# EAGLE schematic MicroRC-C (EAGLE 6.5.0)
CHECKED: K.OLINGER; DATABASE: ./BOM/MicroRC-PARTSDB.txt; DATE: 10/10/06; DRAWN: R.STARR; DRGNO: ED-3XX-01; REV: C

## Sheet 1 of 3
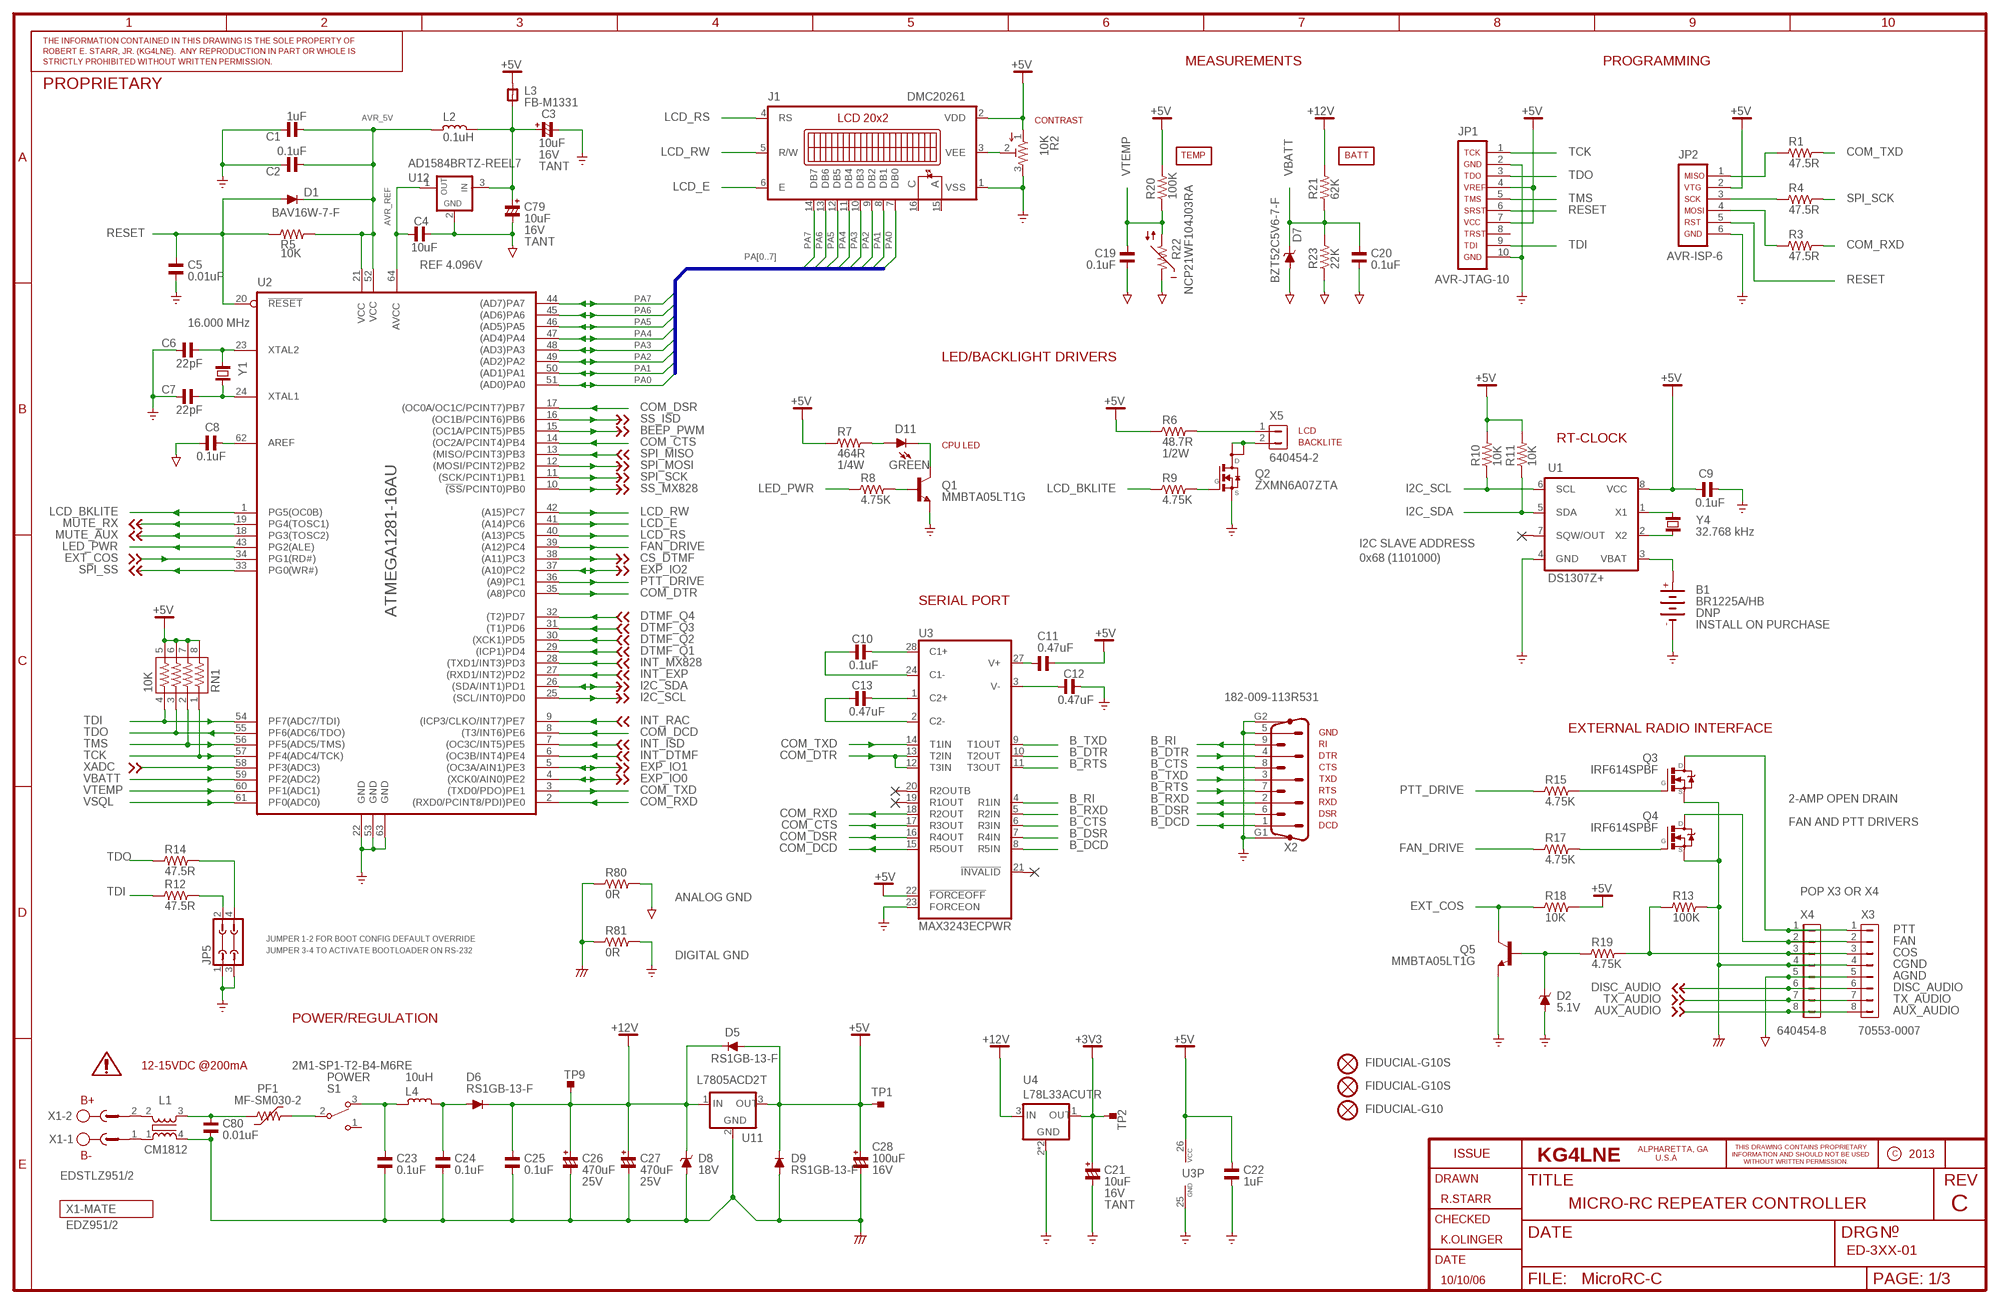
[diagram p0: schematic, sheet 1]
JMP1 (JUMP-Q): BOM: EXCLUDE
JMP2 (JUMP-Q): BOM: EXCLUDE
X1-MATE (BOM-ENTRY): PARTNO: EDZ951/2

### Parts
B1  BR1225A/HB  BR1225  [BR1225]
C1  1uF  C_0805  [C0805]
C2  0.1uF  C_0805  [C0805]
C3  10uF  CP_3528  [C3528/T]
C4  10uF  C_0805  [C0805]
C5  0.01uF  C_0805  [C0805]
C6  22pF  C_0805  [C0805]
C7  22pF  C_0805  [C0805]
C8  0.1uF  C_0805  [C0805]
C9  0.1uF  C_0805  [C0805]
C10  0.1uF  C_0805  [C0805]
C11  0.47uF  C_0805  [C0805]
C12  0.47uF  C_0805  [C0805]
C13  0.47uF  C_0805  [C0805]
C19  0.1uF  C_0805  [C0805]
C20  0.1uF  C_0805  [C0805]
C21  10uF  CP_3528  [C3528/T]
C22  1uF  C_0805  [C0805]
C23  0.1uF  C_1206  [C1206]
C24  0.1uF  C_1206  [C1206]
C25  0.1uF  C_1206  [C1206]
C26  470uF  CP_SV-G  [CSV-G]
C27  470uF  CP_SV-G  [CSV-G]
C28  100uF  CP_SV-E/F  [CSV-E/F]
C79  10uF  CP_3528  [C3528/T]
C80  0.01uF  C_1206  [C1206]
D1  BAV16W-7-F  DIODE-SOD123  [SOD123]
D2  5.1V  ZENER-DIODESOD123  [SOD123]
D5  RS1GB-13-F  S1GB-13  [SMB]
D6  RS1GB-13-F  S1GB-13  [SMB]
D7  BZT52C5V6-7-F  ZENER-DIODESOD123  [SOD123]
D8  18V  ZENER-DIODESMB  [SMB]
D9  RS1GB-13-F  S1GB-13  [SMB]
D11  GREEN  LED535XX  [LED535]
FIDUCIAL1  FIDUCIAL-G10S  [G10S]
FIDUCIAL2  FIDUCIAL-G10S  [G10S]
FIDUCIAL3  FIDUCIAL-G10  [G10]
J1  DMC20261  [DMC20261]
JP1  AVR-JTAG-10  [AVR-JTAG-10]
JP2  AVR-ISP-6  [AVR-ISP-6]
JP5  JP2Q  [JP2Q]
L1  CM1812  [CM1812]
L2  0.1uH  L_1206  [L1206]
L3  FB-M1331  FB_1206  [L1206]
L4  10uH  L-PM3308  [PM-13]
PF1  MF-SM030-2  POLYSWITCH-SMD-7555  [SMD-7555]
Q1  MMBTA05LT1G  MMBTA05LT1  [SOT23]
Q2  ZXMN6A07ZTA  ZXMN6A07Z  [SOT89]
Q3  IRF614SPBF  IRF614  [D2PAK]
Q4  IRF614SPBF  IRF614  [D2PAK]
Q5  MMBTA05LT1G  MMBTA05LT1  [SOT23]
R1  47.5R  R_0805  [R0805]
R2  10K  TRIM_EU-EVM-L4G  [EVM-L4G]
R3  47.5R  R_0805  [R0805]
R4  47.5R  R_0805  [R0805]
R5  10K  R_0805  [R0805]
R6  48.7R  R_2010  [R2010]
R7  464R  R_1210  [R1210]
R8  4.75K  R_0805  [R0805]
R9  4.75K  R_0805  [R0805]
R10  10K  R_0805  [R0805]
R11  10K  R_0805  [R0805]
R12  47.5R  R_0805  [R0805]
R13  100K  R_0805  [R0805]
R14  47.5R  R_0805  [R0805]
R15  4.75K  R_0805  [R0805]
R17  4.75K  R_0805  [R0805]
R18  10K  R_0805  [R0805]
R19  4.75K  R_0805  [R0805]
R20  100K  R_0805  [R0805]
R21  62K  R_0805  [R0805]
R22  NCP21WF104J03RA  NCP-0805  [R0805]
R23  22K  R_0805  [R0805]
R80  0R  R_0805  [R0805]
R81  0R  R_0805  [R0805]
RN1  10K  744-8  [744-8]
S1  2M1-SP1-T2-B4-M6RE  CK-A  [CK-A]
TP1  TPTP10SQ  [TP10SQ]
TP2  TPTP10SQ  [TP10SQ]
TP9  TPTP10SQ  [TP10SQ]
U1  DS1307Z+  DS1307Z  [SO08]
U2  ATMEGA1281-16AU  MEGA1281/2561  [TQFP64-AEB]
U3  MAX3243ECPWR  MAX3243PW  [TSSOP28]
U4  L78L33ACUTR  L78LXXCU/BU  [SOT89-4]
U11  L7805ACD2T  L78XXD2T  [D2PAK]
U12  AD1584BRTZ-REEL7  AD158X  [SOT23]
X1  EDSTLZ951/2  EDSTLZ-2-951  [951-2]
X2  182-009-113R531  NC182M9-VS  [NC182M9]
X3  70553-0007  HDR-1X8-70553-?  [70553-08]
X4  640454-8  MTA08-100  [MTA08-100]
X5  640454-2  HDR-1X2-MTA-100  [MTA-100-2V]
Y1  16.000 MHz  CRYTALTC38H  [TC38H]
Y4  32.768 kHz  CRYTALTC26H  [TC26H]

### Nets
+3V3: C21.+ TP2.TP U4.1(OUT) ; also sheet 2
+5V: C9.1 C11.1 C22.1 C28.+ D5.A D9.C J1.2(VDD) JP1.4 JP1.7 JP2.2 L3.2 R2.1 R6.1 R7.1 R10.2 R11.2 R18.2 R20.2 RN1.5 RN1.6 RN1.7 RN1.8 TP1.TP U1.8(VCC) U3.22(!FORCEOFF!) U3.26(VCC) U11.3(OUT) ; also sheet 2
+12V: C25.1 C26.+ C27.+ D5.C D6.C D8.C R21.2 TP9.TP U4.3(IN) U11.1(IN) ; also sheet 2
AGND: C4.1 C8.2 C19.2 C20.2 C79.- D7.A R22.1 R23.1 R80.2 U12.2(GND) X3.5 X4.5 ; supply symbol labelled AGND_ ; also sheet 2
AUX_AUDIO: X3.8 X4.8 ; also sheet 2
AVR_5V: C1.1 C2.1 D1.C L2.2 R5.2 U2.21(VCC) U2.52(VCC1)
AVR_REF: C4.2 U2.64(AVCC) U12.1(OUT)
B_CTS: U3.6(R3IN) X2.8
B_DCD: U3.8(R5IN) X2.1
B_DSR: U3.7(R4IN) X2.6
B_DTR: U3.10(T2OUT) X2.4
B_RI: U3.4(R1IN) X2.9
B_RTS: U3.11(T3OUT) X2.7
B_RXD: U3.5(R2IN) X2.2
B_TXD: U3.9(T1OUT) X2.3
BEEP_PWM: U2.15((OC1A/PCINT5)PB5) ; also sheet 2
CGND: C23.2 C24.2 C25.2 C26.- C27.- C28.- C80.2 D8.A D9.A L1.4 Q3.3(S) Q4.3(S) R13.2 R80.1 R81.1 U11.2(GND) X3.4 X4.4 ; supply symbol labelled CGND_
COM_CTS: U2.14((OC2A/PCINT4)PB4) U3.17(R3OUT)
COM_DCD: U2.8((T3/INT6)PE6) U3.15(R5OUT)
COM_DSR: U2.17((OC0A/OC1C/PCINT7)PB7) U3.16(R4OUT)
COM_DTR: U2.35((A8)PC0) U3.12(T3IN) U3.13(T2IN)
COM_RXD: R3.2 U2.2((RXD0/PCINT8/PDI)PE0) U3.18(R2OUT)
COM_TXD: R1.2 U2.3((TXD0/PDO)PE1) U3.14(T1IN)
COS: R13.1 R19.2 X3.3 X4.3
CS_DTMF: U2.38((A11)PC3) ; also sheet 2
DISC_AUDIO: X3.6 X4.6 ; also sheet 2
DTMF_Q1: U2.29((ICP1)PD4) ; also sheet 2
DTMF_Q2: U2.30((XCK1)PD5) ; also sheet 2
DTMF_Q3: U2.31((T1)PD6) ; also sheet 2
DTMF_Q4: U2.32((T2)PD7) ; also sheet 2
EXP_IO0: U2.4((XCK0/AIN0)PE2) ; also sheet 2
EXP_IO1: U2.5((OC3A/AIN1)PE3) ; also sheet 2
EXP_IO2: U2.37((A10)PC2) ; also sheet 2
EXT_COS: Q5.3(C) R18.1 U2.34(PG1(RD#))
FAN: Q4.2(D) X3.2 X4.2
FAN_DRIVE: R17.1 U2.39((A12)PC4)
GND: B1.- C1.2 C2.2 C3.- C5.2 C6.2 C7.2 C9.2 C12.1 C21.- C22.2 D2.A J1.1(VSS) JP1.2 JP1.10 JP2.6 JP5.1 JP5.3 Q1.2(E) Q2.3(S) Q5.2(E) R2.3 R81.2 U1.4(GND) U2.22(GND) U2.53(GND1) U2.63(GND2) U3.23(FORCEON) U3.25(GND) U4.2(GND) U4.4(GND) X2.5 X2.G1 X2.G2 ; supply symbol labelled GND_ ; also sheet 2
I2C_SCL: R10.1 U1.6(SCL) U2.25((SCL/INT0)PD0) ; also sheet 2
I2C_SDA: R11.1 U1.5(SDA) U2.26((SDA/INT1)PD1) ; also sheet 2
INT_DTMF: U2.6((OC3B/INT4)PE4) ; also sheet 2
INT_EXP: U2.27((RXD1/INT2)PD2) ; also sheet 2
INT_ISD: U2.7((OC3C/INT5)PE5) ; also sheet 2
INT_MX828: U2.28((TXD1/INT3)PD3) ; also sheet 2
INT_RAC: U2.9((ICP3/CLKO/INT7)PE7) ; also sheet 2
LCD_BKLITE: R9.1 U2.1(PG5(OC0B))
LCD_E: J1.6(E) U2.41((A14)PC6)
LCD_RS: J1.4(RS) U2.40((A13)PC5)
LCD_RW: J1.5(R/W) U2.42((A15)PC7)
LED_PWR: R8.1 U2.43(PG2(ALE))
MUTE_AUX: U2.18(PG3(TOSC2)) ; also sheet 2
MUTE_RX: U2.19(PG4(TOSC1)) ; also sheet 2
N$1: L1.1 X1.1
N$2: C8.1 U2.62(AREF)
N$9: JP5.2 R12.2
N$13: C23.1 L4.1 S1.3(O)
N$14: L1.2 X1.2
N$19: C24.1 D6.A L4.2
N$20: U1.1(X1) Y4.2
N$21: U1.2(X2) Y4.1
N$30: C7.1 U2.24(XTAL1) Y1.1
N$31: JP5.4 R14.2
N$34: C12.2 U3.3(V-)
N$36: C11.2 U3.27(V+)
N$38: C6.1 U2.23(XTAL2) Y1.2
N$39: C13.1 U3.1(C2+)
N$44: C10.1 U3.28(C1+)
N$45: C13.2 U3.2(C2-)
N$46: C10.2 U3.24(C1-)
N$63: B1.+ U1.3(VBAT)
N$66: Q3.1(G) R15.2
N$67: Q2.1(G) R9.2
N$68: Q2.2(D) Q2.4(D2) X5.2
N$69: R6.2 X5.1
N$76: D2.C Q5.1(B) R19.1
N$78: PF1.2 S1.2(P)
N$79: Q4.1(G) R17.2
N$81: C80.1 L1.3 PF1.1
N$86: C3.+ C79.+ L2.1 L3.1 U12.3(IN)
N$90: D11.K(C) Q1.3(C)
N$91: D11.A R7.2
N$92: Q1.1(B) R8.2
N$105: JP2.1 R1.1
N$107: JP2.3 R4.1
N$108: JP2.4 R3.1
PA0: J1.7(DB0) U2.51((AD0)PA0)
PA1: J1.8(DB1) U2.50((AD1)PA1)
PA2: J1.9(DB2) U2.49((AD2)PA2)
PA3: J1.10(DB3) U2.48((AD3)PA3)
PA4: J1.11(DB4) U2.47((AD4)PA4)
PA5: J1.12(DB5) U2.46((AD5)PA5)
PA6: J1.13(DB6) U2.45((AD6)PA6)
PA7: J1.14(DB7) U2.44((AD7)PA7)
PTT: Q3.2(D) X3.1 X4.1
PTT_DRIVE: R15.1 U2.36((A9)PC1)
RESET: C5.1 D1.A JP1.6 JP2.5 R5.1 U2.20(!RESET!)
SPI_MISO: U2.13((MISO/PCINT3)PB3) ; also sheet 2
SPI_MOSI: U2.12((MOSI/PCINT2)PB2) ; also sheet 2
SPI_SCK: R4.2 U2.11((SCK/PCINT1)PB1) ; also sheet 2
SPI_SS: U2.33(PG0(WR#)) ; also sheet 2
SS_ISD: U2.16((OC1B/PCINT6)PB6) ; also sheet 2
SS_MX828: U2.10(!(SS!/PCINT0)PB0) ; also sheet 2
TCK: JP1.1 RN1.1 U2.57(PF4(ADC4/TCK))
TDI: JP1.9 R12.1 RN1.4 U2.54(PF7(ADC7/TDI))
TDO: JP1.3 R14.1 RN1.3 U2.55(PF6(ADC6/TDO))
TMS: JP1.5 RN1.2 U2.56(PF5(ADC5/TMS))
TX_AUDIO: X3.7 X4.7 ; also sheet 2
VBATT: C20.1 D7.C R21.1 R23.2 U2.59(PF2(ADC2))
VEE_LCD: J1.3(VEE) R2.2
VSQL: U2.61(PF0(ADC0)) ; also sheet 2
VTEMP: C19.1 R20.1 R22.2 U2.60(PF1(ADC1))
XADC: U2.58(PF3(ADC3)) ; also sheet 2
Unconnected: J1.15(A) J1.16(C) JP1.8 S1.1(S) U1.7(SQW/OUT) U3.19(R1OUT) U3.20(R2OUTB) U3.21(!INVALID!)

### Buses
PA[0..7]

### Notes on the sheet
- MEASUREMENTS | PROGRAMMING
- CONTRAST
- TEMP | BATT
- REF 4.096V
- LED/BACKLIGHT DRIVERS
- LCD
- RT-CLOCK
- BACKLITE
- CPU LED
- I2C SLAVE ADDRESS
- 0x68 (1101000)
- SERIAL PORT
- EXTERNAL RADIO INTERFACE
- GND
- RI
- DTR
- CTS
- TXD
- RTS
- 2-AMP OPEN DRAIN
- RXD
- DSR
- FAN AND PTT DRIVERS
- DCD
- ANALOG GND
- JUMPER 1-2 FOR BOOT CONFIG DEFAULT OVERRIDE
- JUMPER 3-4 TO ACTIVATE BOOTLOADER ON RS-232
- DIGITAL GND
- POWER/REGULATION
- 12-15VDC @200mA
- POWER
- B+
- B-
- MICRO-RC REPEATER CONTROLLER

## Sheet 2 of 3
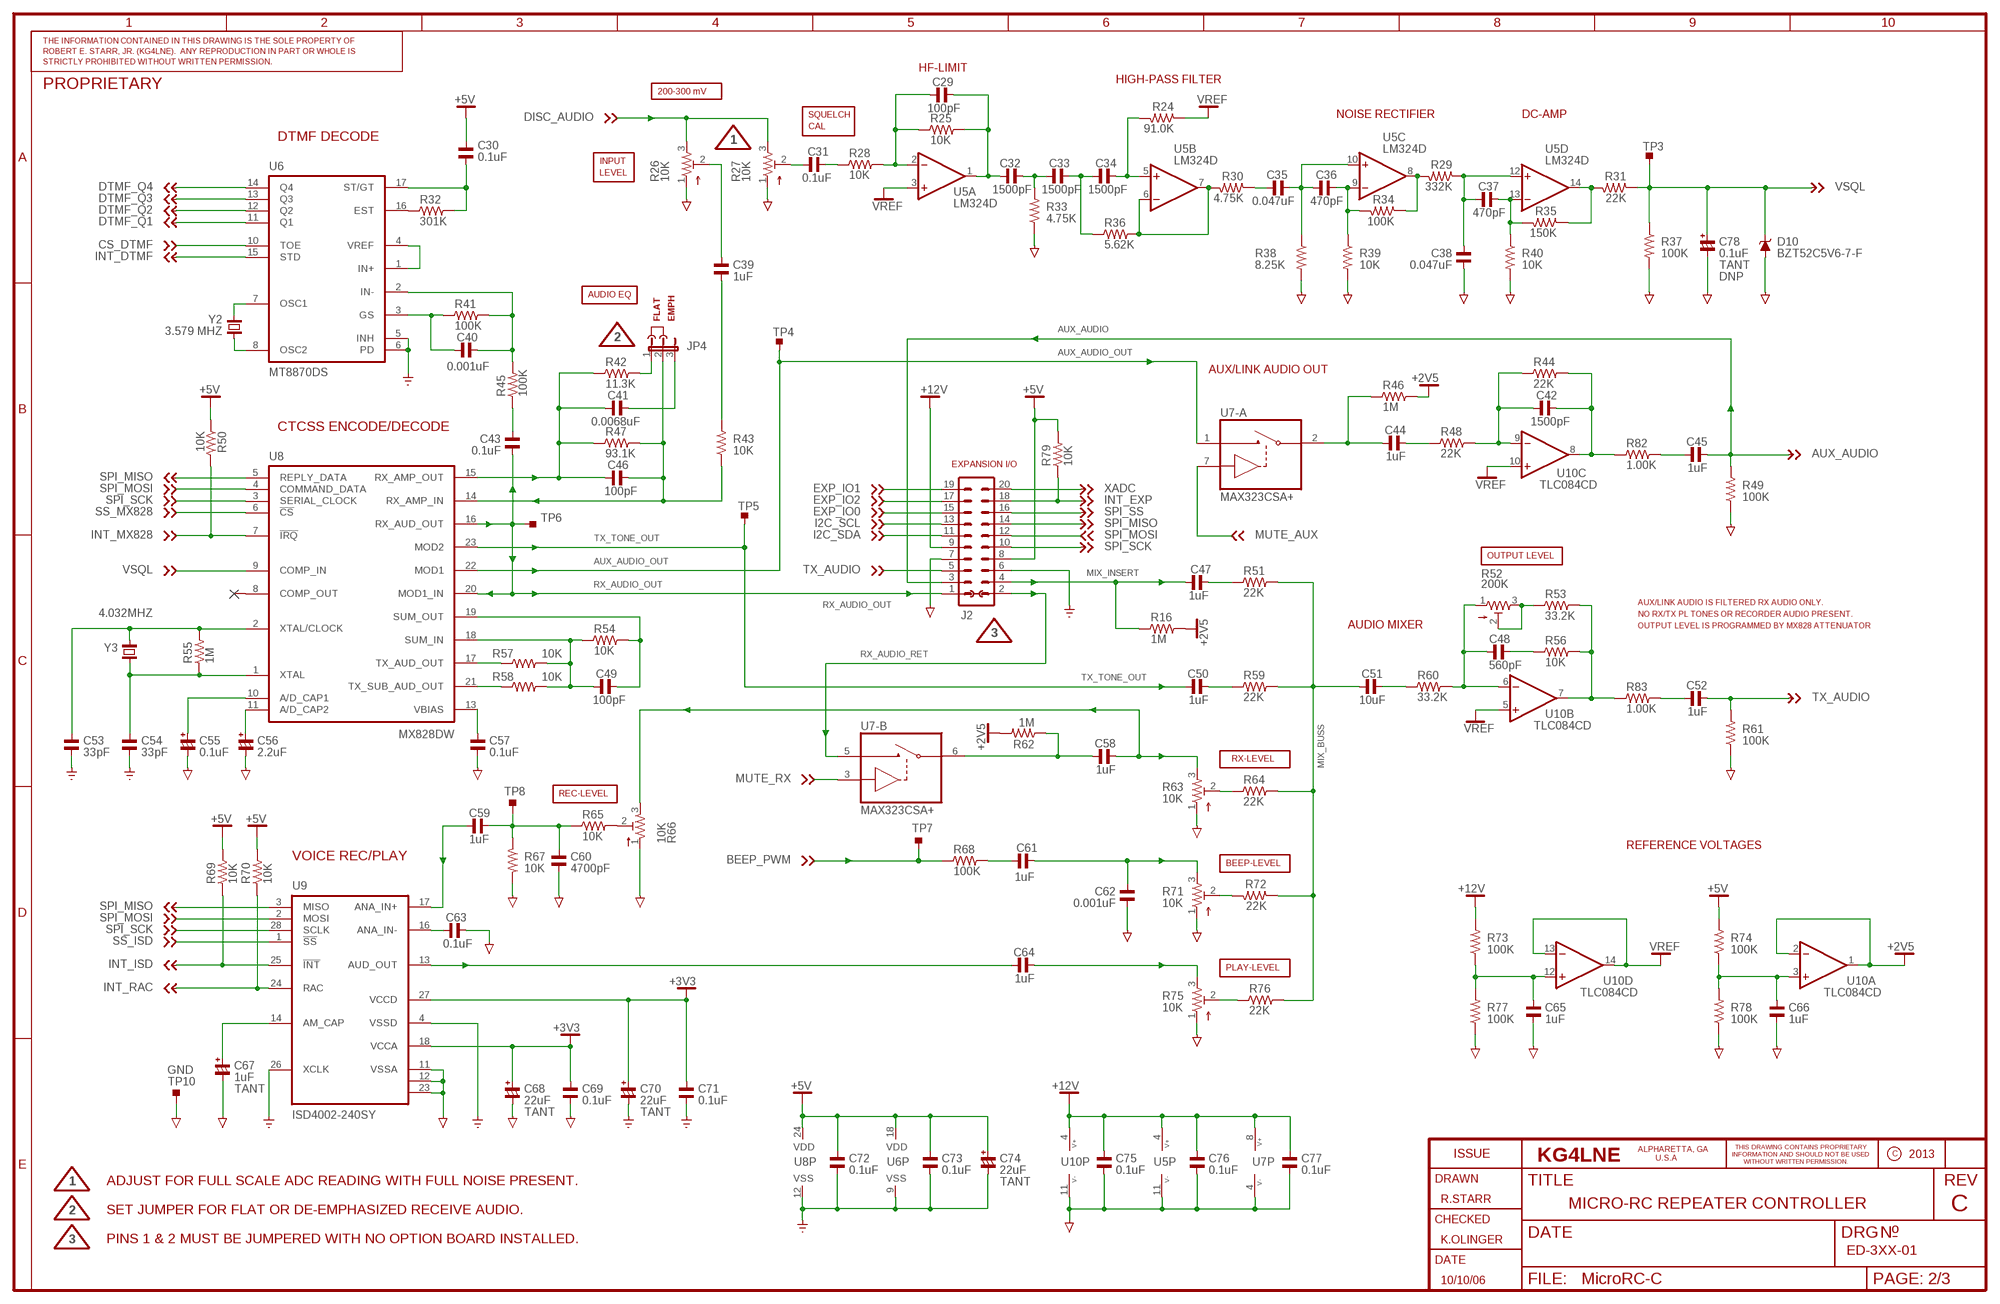
[diagram p1: schematic, sheet 2]
JUMPER (JUMPER): BOM: EXCLUDE

### Parts
C29  100pF  C_0805  [C0805]
C30  0.1uF  C_0805  [C0805]
C31  0.1uF  C_0805  [C0805]
C32  1500pF  C_0805  [C0805]
C33  1500pF  C_0805  [C0805]
C34  1500pF  C_0805  [C0805]
C35  0.047uF  C_0805  [C0805]
C36  470pF  C_0805  [C0805]
C37  470pF  C_0805  [C0805]
C38  0.047uF  C_0805  [C0805]
C39  1uF  C_0805  [C0805]
C40  0.001uF  C_0805  [C0805]
C41  0.0068uF  C_0805  [C0805]
C42  1500pF  C_0805  [C0805]
C43  0.1uF  C_0805  [C0805]
C44  1uF  C_0805  [C0805]
C45  1uF  C_0805  [C0805]
C46  100pF  C_0805  [C0805]
C47  1uF  C_0805  [C0805]
C48  560pF  C_0805  [C0805]
C49  100pF  C_0805  [C0805]
C50  1uF  C_0805  [C0805]
C51  10uF  C_0805  [C0805]
C52  1uF  C_0805  [C0805]
C53  33pF  C_0805  [C0805]
C54  33pF  C_0805  [C0805]
C55  0.1uF  CP_3216  [C3216/T]
C56  2.2uF  CP_3216  [C3216/T]
C57  0.1uF  C_0805  [C0805]
C58  1uF  C_0805  [C0805]
C59  1uF  C_0805  [C0805]
C60  4700pF  C_0805  [C0805]
C61  1uF  C_0805  [C0805]
C62  0.001uF  C_0805  [C0805]
C63  0.1uF  C_0805  [C0805]
C64  1uF  C_0805  [C0805]
C65  1uF  C_0805  [C0805]
C66  1uF  C_0805  [C0805]
C67  1uF  CP_3216  [C3216/T]
C68  22uF  CP_3528  [C3528/T]
C69  0.1uF  C_0805  [C0805]
C70  22uF  CP_3528  [C3528/T]
C71  0.1uF  C_0805  [C0805]
C72  0.1uF  C_0805  [C0805]
C73  0.1uF  C_0805  [C0805]
C74  22uF  CP_3528  [C3528/T]
C75  0.1uF  C_0805  [C0805]
C76  0.1uF  C_0805  [C0805]
C77  0.1uF  C_0805  [C0805]
C78  0.1uF  CP_3216  [C3216/T]
D10  BZT52C5V6-7-F  ZENER-DIODESOD123  [SOD123]
J2  MA10-2  [MA10-2]
JP4  JP2E  [JP2]
R16  1M  R_0805  [R0805]
R24  91.0K  R_0805  [R0805]
R25  10K  R_0805  [R0805]
R26  10K  TRIM_EU-EVME-SIDE  [EVME-SIDE]
R27  10K  TRIM_EU-EVME-SIDE  [EVME-SIDE]
R28  10K  R_0805  [R0805]
R29  332K  R_0805  [R0805]
R30  4.75K  R_0805  [R0805]
R31  22K  R_0805  [R0805]
R32  301K  R_0805  [R0805]
R33  4.75K  R_0805  [R0805]
R34  100K  R_0805  [R0805]
R35  150K  R_0805  [R0805]
R36  5.62K  R_0805  [R0805]
R37  100K  R_0805  [R0805]
R38  8.25K  R_0805  [R0805]
R39  10K  R_0805  [R0805]
R40  10K  R_0805  [R0805]
R41  100K  R_0805  [R0805]
R42  11.3K  R_0805  [R0805]
R43  10K  R_0805  [R0805]
R44  22K  R_0805  [R0805]
R45  100K  R_0805  [R0805]
R46  1M  R_0805  [R0805]
R47  93.1K  R_0805  [R0805]
R48  22K  R_0805  [R0805]
R49  100K  R_0805  [R0805]
R50  10K  R_0805  [R0805]
R51  22K  R_0805  [R0805]
R52  200K  TRIM_EU-EVME-SIDE  [EVME-SIDE]
R53  33.2K  R_0805  [R0805]
R54  10K  R_0805  [R0805]
R55  1M  R_0805  [R0805]
R56  10K  R_0805  [R0805]
R57  10K  R_0805  [R0805]
R58  10K  R_0805  [R0805]
R59  22K  R_0805  [R0805]
R60  33.2K  R_0805  [R0805]
R61  100K  R_0805  [R0805]
R62  1M  R_0805  [R0805]
R63  10K  TRIM_EU-EVME-SIDE  [EVME-SIDE]
R64  22K  R_0805  [R0805]
R65  10K  R_0805  [R0805]
R66  10K  TRIM_EU-EVM-L4G  [EVM-L4G]
R67  10K  R_0805  [R0805]
R68  100K  R_0805  [R0805]
R69  10K  R_0805  [R0805]
R70  10K  R_0805  [R0805]
R71  10K  TRIM_EU-EVME-SIDE  [EVME-SIDE]
R72  22K  R_0805  [R0805]
R73  100K  R_0805  [R0805]
R74  100K  R_0805  [R0805]
R75  10K  TRIM_EU-EVME-SIDE  [EVME-SIDE]
R76  22K  R_0805  [R0805]
R77  100K  R_0805  [R0805]
R78  100K  R_0805  [R0805]
R79  10K  R_0805  [R0805]
R82  1.00K  R_0805  [R0805]
R83  1.00K  R_0805  [R0805]
TP3  TPTP10SQ  [TP10SQ]
TP4  TPTP10SQ  [TP10SQ]
TP5  TPTP10SQ  [TP10SQ]
TP6  TPTP10SQ  [TP10SQ]
TP7  TPTP10SQ  [TP10SQ]
TP8  TPS-SMD-10SN  [SMD-10SN]
TP10  TPS-SMD-10SN  [SMD-10SN]
U5  LM324D  [SO14]
U6  MT8870DS  CM8870CS  [SO18W]
U7  MAX323CSA+  MAX323CSA  [SO08]
U8  MX828DW  MX828DS  [SSOP24]
U9  ISD4002-240SY  ISD4002S  [SO28W]
U10  TLC084CD  TL084D  [SO14]
Y2  3.579 MHZ  CRYTALTC310H  [TC310H]
Y3  4.032MHZ  CRYTALSM49  [SM49]

### Nets
+2V5: R16.2 R46.2 R62.2 U10.1(A:OUT) U10.2(A:-IN)
+3V3: C68.+ C69.1 C70.+ C71.1 U9.18(VCCA) U9.27(VCCD) ; also sheet 1
+5V: C30.2 C72.1 C73.1 C74.+ J2.8 R50.1 R69.2 R70.2 R74.2 R79.2 U6.18(VDD) U8.24(P:VDD) ; also sheet 1
+12V: C75.1 C76.1 C77.1 J2.9 R73.2 U5.4(P:V+) U7.8(P:V+) U10.4(P:V+) ; also sheet 1
AGND: C38.1 C55.- C56.- C57.2 C60.2 C62.2 C63.1 C65.2 C66.2 C67.- C68.- C69.2 C75.2 C76.2 C77.2 C78.- D10.A J2.7 R26.1 R27.1 R33.1 R37.2 R38.2 R39.2 R40.2 R49.1 R61.1 R63.1 R66.1 R67.2 R71.1 R75.1 R77.1 R78.1 TP10.TP U5.11(P:V-) U7.4(P:V-) U9.11(VSSA) U9.12(VSSA) U9.23(VSSA) U10.11(P:V-) ; supply symbol labelled AGND_ ; also sheet 1
AUX_AUDIO: C45.2 J2.3 R49.2 ; also sheet 1
AUX_AUDIO_OUT: TP4.TP U7.1(-A:NO) U8.22(A:MOD1)
BEEP_PWM: R68.1 TP7.TP ; also sheet 1
CS_DTMF: U6.10(TOE) ; also sheet 1
DISC_AUDIO: R26.3 R27.3 ; also sheet 1
DTMF_Q1: U6.11(Q1) ; also sheet 1
DTMF_Q2: U6.12(Q2) ; also sheet 1
DTMF_Q3: U6.13(Q3) ; also sheet 1
DTMF_Q4: U6.14(Q4) ; also sheet 1
EXP_IO0: J2.15 ; also sheet 1
EXP_IO1: J2.19 ; also sheet 1
EXP_IO2: J2.17 ; also sheet 1
GND: C53.2 C54.2 C70.- C71.2 C72.2 C73.2 C74.- J2.6 U6.5(INH) U6.6(PD) U6.9(VSS) U8.12(P:VSS) U9.4(VSSD) U9.26(XCLK) ; supply symbol labelled GND_ ; also sheet 1
I2C_SCL: J2.13 ; also sheet 1
I2C_SDA: J2.11 ; also sheet 1
INT_DTMF: U6.15(STD) ; also sheet 1
INT_EXP: J2.18 R79.1 ; also sheet 1
INT_ISD: R69.1 U9.25(!INT!) ; also sheet 1
INT_MX828: R50.2 U8.7(A:!IRQ!) ; also sheet 1
INT_RAC: R70.1 U9.24(RAC) ; also sheet 1
MIX_BUSS: C51.1 R51.2 R59.2 R64.2 R72.1 R76.2
MIX_INSERT: C47.1 J2.4 R16.1
MUTE_AUX: U7.7(-A:IN) ; also sheet 1
MUTE_RX: U7.3(-B:IN) ; also sheet 1
N$3: C45.1 R82.2
N$4: C39.2 R26.2
N$5: C58.1 R62.1 U7.6(-B:COM)
N$6: R63.2 R64.1
N$7: R65.2 R66.2
N$8: C63.2 U9.16(ANA_IN-)
N$10: C56.+ U8.11(A:A/D_CAP2)
N$11: C52.1 R83.2
N$12: JP4.1 R42.2
N$15: C59.1 C60.1 R65.1 R67.1 TP8.TP
N$16: U6.7(OSC1) Y2.2
N$17: U6.8(OSC2) Y2.1
N$18: U6.1(IN+) U6.4(VREF)
N$22: C61.1 R68.2
N$23: R75.2 R76.1
N$24: C65.1 R73.1 R77.2 U10.12(D:+IN)
N$25: C64.2 R75.3
N$26: C40.2 R41.2 R45.2 U6.2(IN-)
N$27: C41.2 JP4.3
N$28: C40.1 R41.1 U6.3(GS)
N$29: C30.1 R32.2 U6.17(ST/GT)
N$32: R32.1 U6.16(EST)
N$33: C59.2 U9.17(ANA_IN+)
N$35: C44.2 R48.1
N$37: C64.1 U9.13(AUD_OUT)
N$40: C43.2 R45.1
N$41: C55.+ U8.10(A:A/D_CAP1)
N$42: C48.2 R56.1
N$43: R30.2 R36.2 U5.6(B:-IN) U5.7(B:OUT)
N$47: C31.1 R27.2
N$48: C44.1 R46.1 U7.2(-A:COM)
N$49: C61.2 C62.1 R71.3
N$50: R71.2 R72.2
N$52: C53.1 R55.2 U8.2(A:XTAL/CLOCK) Y3.1
N$53: C54.1 R55.1 U8.1(A:XTAL) Y3.2
N$54: C49.2 R54.2 U8.19(A:SUM_OUT)
N$55: R53.2 R56.2 R83.1 U10.7(B:OUT)
N$56: C39.1 R43.2
N$57: C46.2 JP4.2 R43.1 R47.2 U8.14(A:RX_AMP_IN)
N$58: C57.1 U8.13(A:VBIAS)
N$59: C41.1 C46.1 R42.1 R47.1 U8.15(A:RX_AMP_OUT)
N$60: C48.1 R52.1 R60.2 U10.6(B:-IN)
N$61: C58.2 R63.3 R66.3
N$62: C50.2 R59.1
N$64: C32.2 C33.1 R33.2
N$70: R29.2 R34.1 U5.8(C:OUT)
N$72: C36.2 R34.2 R39.1 U5.9(C:-IN)
N$73: R57.1 U8.17(A:TX_AUD_OUT)
N$77: C35.1 R30.1
N$80: R58.1 U8.21(A:TX_SUB_AUD_OUT)
N$82: C34.2 R24.2 U5.5(B:+IN)
N$83: R52.2 R52.3 R53.1
N$84: C67.+ U9.14(AM_CAP)
N$85: C42.1 R44.1 R48.2 U10.9(C:-IN)
N$87: C42.2 R44.2 R82.1 U10.8(C:OUT)
N$88: C33.2 C34.1 R36.1
N$89: C49.1 R54.1 R57.2 R58.2 U8.18(A:SUM_IN)
N$93: C47.2 R51.1
N$94: C29.2 C32.1 R25.2 U5.1(A:OUT)
N$95: C35.2 C36.1 R38.1 U5.10(C:+IN)
N$96: C37.1 C38.2 R29.1 U5.12(D:+IN)
N$98: C29.1 R25.1 R28.2 U5.2(A:-IN)
N$99: C31.2 R28.1
N$102: C37.2 R35.2 R40.1 U5.13(D:-IN)
N$106: C51.2 R60.1
N$109: C66.1 R74.1 R78.2 U10.3(A:+IN)
N$111: R31.2 R35.1 U5.14(D:OUT)
RX_AUDIO_OUT: C43.1 J2.1 TP6.TP U8.16(A:RX_AUD_OUT) U8.20(A:MOD1_IN)
RX_AUDIO_RET: J2.2 U7.5(-B:NO)
SPI_MISO: J2.14 U8.5(A:REPLY_DATA) U9.3(MISO) ; also sheet 1
SPI_MOSI: J2.12 U8.4(A:COMMAND_DATA) U9.2(MOSI) ; also sheet 1
SPI_SCK: J2.10 U8.3(A:SERIAL_CLOCK) U9.28(SCLK) ; also sheet 1
SPI_SS: J2.16 ; also sheet 1
SS_ISD: U9.1(!SS!) ; also sheet 1
SS_MX828: U8.6(A:!CS!) ; also sheet 1
TX_AUDIO: C52.2 J2.5 R61.2 ; also sheet 1
TX_TONE_OUT: C50.1 TP5.TP U8.23(A:MOD2)
VREF: R24.1 U5.3(A:+IN) U10.5(B:+IN) U10.10(C:+IN) U10.13(D:-IN) U10.14(D:OUT)
VSQL: C78.+ D10.C R31.1 R37.1 TP3.TP U8.9(A:COMP_IN) ; also sheet 1
XADC: J2.20 ; also sheet 1
Unconnected: U8.8(A:COMP_OUT)

### Notes on the sheet
- HF-LIMIT
- HIGH-PASS FILTER
- 200-300 mV
- SQUELCH | NOISE RECTIFIER | DC-AMP
- CAL
- DTMF DECODE
- INPUT
- LEVEL
- AUDIO EQ
- FLAT | EMPH
- AUX/LINK AUDIO OUT
- CTCSS ENCODE/DECODE
- EXPANSION I/O
- OUTPUT LEVEL
- AUX/LINK AUDIO IS FILTERED RX AUDIO ONLY.
- NO RX/TX PL TONES OR RECORDER AUDIO PRESENT.
- AUDIO MIXER | OUTPUT LEVEL IS PROGRAMMED BY MX828 ATTENUATOR
- RX-LEVEL
- REC-LEVEL
- REFERENCE VOLTAGES
- VOICE REC/PLAY
- BEEP-LEVEL
- PLAY-LEVEL
- ADJUST FOR FULL SCALE ADC READING WITH FULL NOISE PRESENT.
- MICRO-RC REPEATER CONTROLLER
- SET JUMPER FOR FLAT OR DE-EMPHASIZED RECEIVE AUDIO.
- PINS 1 & 2 MUST BE JUMPERED WITH NO OPTION BOARD INSTALLED.

## Sheet 3 of 3
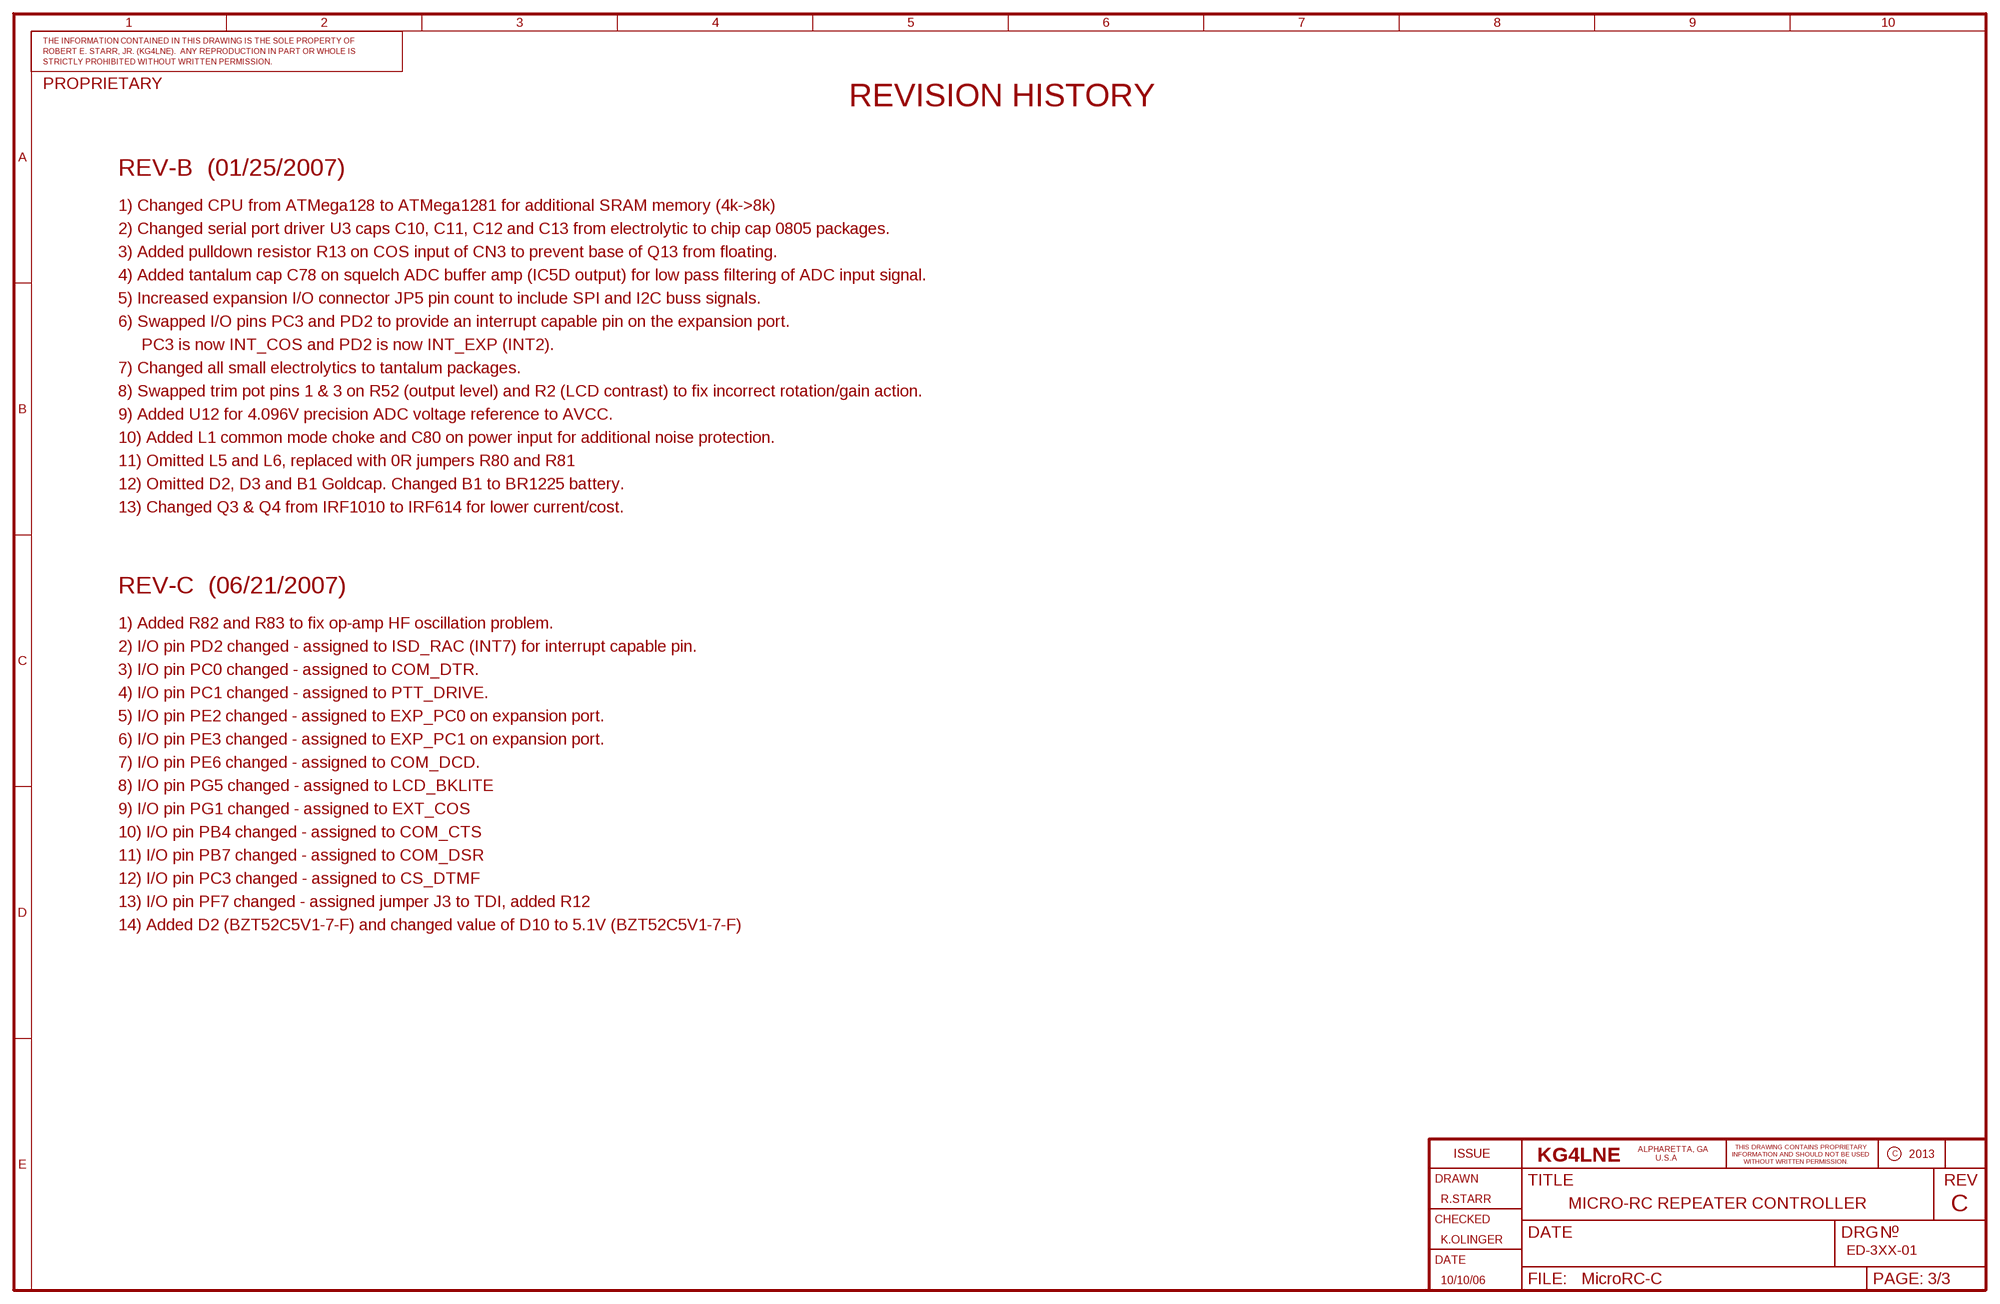
[diagram p2: schematic, sheet 3]

### Notes on the sheet
- REVISION HISTORY
- REV-B  (01/25/2007)
- 1) Changed CPU from ATMega128 to ATMega1281 for additional SRAM memory (4k->8k)
- 2) Changed serial port driver U3 caps C10, C11, C12 and C13 from electrolytic to chip cap 0805 packages.
- 3) Added pulldown resistor R13 on COS input of CN3 to prevent base of Q13 from floating.
- 4) Added tantalum cap C78 on squelch ADC buffer amp (IC5D output) for low pass filtering of ADC input signal.
- 5) Increased expansion I/O connector JP5 pin count to include SPI and I2C buss signals.
- 6) Swapped I/O pins PC3 and PD2 to provide an interrupt capable pin on the expansion port.
- PC3 is now INT_COS and PD2 is now INT_EXP (INT2).
- 7) Changed all small electrolytics to tantalum packages.
- 8) Swapped trim pot pins 1 & 3 on R52 (output level) and R2 (LCD contrast) to fix incorrect rotation/gain action.
- 9) Added U12 for 4.096V precision ADC voltage reference to AVCC.
- 10) Added L1 common mode choke and C80 on power input for additional noise protection.
- 11) Omitted L5 and L6, replaced with 0R jumpers R80 and R81
- 12) Omitted D2, D3 and B1 Goldcap. Changed B1 to BR1225 battery.
- 13) Changed Q3 & Q4 from IRF1010 to IRF614 for lower current/cost.
- REV-C  (06/21/2007)
- 1) Added R82 and R83 to fix op-amp HF oscillation problem.
- 2) I/O pin PD2 changed - assigned to ISD_RAC (INT7) for interrupt capable pin.
- 3) I/O pin PC0 changed - assigned to COM_DTR.
- 4) I/O pin PC1 changed - assigned to PTT_DRIVE.
- 5) I/O pin PE2 changed - assigned to EXP_PC0 on expansion port.
- 6) I/O pin PE3 changed - assigned to EXP_PC1 on expansion port.
- 7) I/O pin PE6 changed - assigned to COM_DCD.
- 8) I/O pin PG5 changed - assigned to LCD_BKLITE
- 9) I/O pin PG1 changed - assigned to EXT_COS
- 10) I/O pin PB4 changed - assigned to COM_CTS
- 11) I/O pin PB7 changed - assigned to COM_DSR
- 12) I/O pin PC3 changed - assigned to CS_DTMF
- 13) I/O pin PF7 changed - assigned jumper J3 to TDI, added R12
- 14) Added D2 (BZT52C5V1-7-F) and changed value of D10 to 5.1V (BZT52C5V1-7-F)
- MICRO-RC REPEATER CONTROLLER

## Library data of the parts
B1 = battery:BR1225: LI BATTERY Panasonic; DNP: T; PARTNO: BR1225A/HB; PLACE: INSTALL ON PURCHASE
C1 C22 C39 C44 C45 C47 C50 C52 C58 C59 C61 C64-C66 = rc-master:C_: NON-POLARIZED CAP; PARTNO: C0805C105Z3VACTU
C2 C8-C10 C19 C20 C30 C31 C43 C57 C63 C69 C71-C73 C75-C77 = rc-master:C_: NON-POLARIZED CAP; PARTNO: C0805F104K5RACTU
C3 C21 C79 = rc-master:CP_: POLARIZED CAP; PARTNO: T491B106M016AT; TYPE: TANT; VOLT: 16V
C4 C51 = rc-master:C_: NON-POLARIZED CAP; PARTNO: C0805C106K9PACTU
C5 = rc-master:C_: NON-POLARIZED CAP; PARTNO: C0805C103K5RACTU
C6 C7 = rc-master:C_: NON-POLARIZED CAP; PARTNO: C0805C220J5GACTU
C11-C13 = rc-master:C_: NON-POLARIZED CAP; PARTNO: C0805F474K3RACTU
C23-C25 = rc-master:C_: NON-POLARIZED CAP; PARTNO: C1206C104K5RACTU
C26 C27 = rc-master:CP_: POLARIZED CAP; PARTNO: EEE-1EA471P; VOLT: 25V
C28 = rc-master:CP_: POLARIZED CAP; PARTNO: EEE-1CA101P; VOLT: 16V
C29 C46 C49 = rc-master:C_: NON-POLARIZED CAP; PARTNO: C0805C101J5GACTU
C32-C34 C42 = rc-master:C_: NON-POLARIZED CAP; PARTNO: C0805C152K5RACTU
C35 C38 = rc-master:C_: NON-POLARIZED CAP; PARTNO: C0805C473K5RACTU
C36 C37 = rc-master:C_: NON-POLARIZED CAP; PARTNO: C0805C471J5GACTU
C40 C62 = rc-master:C_: NON-POLARIZED CAP; PARTNO: C0805C102K5RACTU
C41 = rc-master:C_: NON-POLARIZED CAP; PARTNO: C0805C682K5RACTU
C48 = rc-master:C_: NON-POLARIZED CAP; PARTNO: C0805C561J5GACTU
C53 C54 = rc-master:C_: NON-POLARIZED CAP; PARTNO: C0805C330J5GACTU
C55 = rc-master:CP_: POLARIZED CAP; PARTNO: T491A104K035AT
C56 = rc-master:CP_: POLARIZED CAP; PARTNO: T491A225K010AT
C60 = rc-master:C_: NON-POLARIZED CAP; PARTNO: C0805C472K5RACTU
C67 = rc-master:CP_: POLARIZED CAP; PARTNO: T491A105K016AT; TYPE: TANT
C68 C70 C74 = rc-master:CP_: POLARIZED CAP; PARTNO: T491B226M016AT; TYPE: TANT
C78 = rc-master:CP_: POLARIZED CAP; DNP: T; PARTNO: DNP; TYPE: TANT
C80 = rc-master:C_: NON-POLARIZED CAP; PARTNO: 12065C103KAT2A
D1 = diode:DIODE-: DIODE; PARTNO: BAV16W-7-F
D2 = diode:ZENER-DIODE: Z-Diode; PARTNO: BZT52C5V1-7-F
D5 D6 D9 = diode:S1GB-13: RECTIFIER - (1N4004WDICT) GPP SMD 400V 1A SMB; PARTNO: RS1GB-13-F
D7 D10 = diode:ZENER-DIODE: Z-Diode; PARTNO: BZT52C5V6-7-F
D8 = diode:ZENER-DIODE: Z-Diode; PARTNO: 1SMB5931BT3G
D11 = led:LED: LED Various Types; PARTNO: 5350T5
FIDUCIAL1-FIDUCIAL3 = dfiducial:FIDUCIAL-: FIDUCIAL MARKS; BOM: EXCLUDE
J1 = display-lcd:DMC20261: LCD DISPLAY Optrex, 20 characters x 2 Lines; BOM: EXCLUDE; PARTNO: *
J2 = con-lstb:MA10-2: PIN HEADER; BOM: EXCLUDE; PARTNO: *
JP1 = atmel:AVR-JTAG-10: AVR JTAG Debug/Programming Header; BOM: EXCLUDE; PARTNO: *
JP2 = atmel:AVR-ISP-6: AVR ISP-6 Serial Programming Header; BOM: EXCLUDE
JP4 = jumper:JP2E: JUMPER; BOM: EXCLUDE; PARTNO: *
JP5 = jumper:JP2Q: JUMPER; BOM: EXCLUDE; PARTNO: *
L1 = inductor-steward:CM1812: COMMON MODE FILTER 5A; PARTNO: CM1812R600R-10
L2 = rc-master:L_: INDUCTOR; PARTNO: PM1210-R10J
L3 = rc-master:FB_: FERRITE BEAD; PARTNO: PM2001-200
L4 = inductors-jwmiller:L: INDUCTORS; PARTNO: PM3308-100M
PF1 = fuse:POLYSWITCH: POLYSWITCH Polyswitch Resetable Fuses; PARTNO: MF-SM030-2; PARTNUM: MF-SM030-2
Q1 Q5 = transistor-npn:MMBTA05*: NPN TRANSISTOR; PARTNO: MMBTA05LT1G
Q2 = zetex:ZXMN6A07Z: N-CHANNEL MOSFET; PARTNO: ZXMN6A07ZTA
Q3 Q4 = transistor-fet:IRF614: N-Channel MOSFET (HEXFET) N-CHANNEL 250V 2.7A TO-220AB; PARTNO: IRF614SPBF
R1 R3 R4 R12 R14 = rc-master:R_: RESISTOR; PARTNO: ERJ-6ENF47R5V
R2 R66 = pot:TRIM_EU-: POTENTIOMETER; PARTNO: EVM-L4GA00B14
R5 R10 R11 R18 R25 R28 R39 R40 R43 R50 R54 R56-R58 R65 R67 R69 R70 R79 = rc-master:R_: RESISTOR; PARTNO: ERJ-6ENF1002V
R6 = rc-master:R_: RESISTOR; PARTNO: ERJ-12SF48R7U; RATE: 1/2W
R7 = rc-master:R_: RESISTOR; PARTNO: ERJ-14NF4640U; RATE: 1/4W
R8 R9 R15 R17 R19 R30 R33 = rc-master:R_: RESISTOR; PARTNO: ERJ-6ENF4751V
R13 R20 R34 R37 R41 R45 R49 R61 R68 R73 R74 R77 R78 = rc-master:R_: RESISTOR; PARTNO: ERJ-6ENF1003V
R16 R46 R55 R62 = rc-master:R_: RESISTOR; PARTNO: ERJ-6ENF1004V
R21 = rc-master:R_: RESISTOR; PARTNO: ERJ-6ENF6192V
R22 = ptc-ntc:NCP: NTC THERMISTOR; PARTNO: NCP21WF104J03RA
R23 R31 R44 R48 R51 R59 R64 R72 R76 = rc-master:R_: RESISTOR; PARTNO: ERJ-6ENF2212V
R24 = rc-master:R_: RESISTOR; PARTNO: ERJ-6ENF9092V
R26 R27 R63 R71 R75 = pot:TRIM_EU-: POTENTIOMETER; PARTNO: EVM-EGGA00B14
R29 = rc-master:R_: RESISTOR; PARTNO: ERJ-6ENF3323V
R32 = rc-master:R_: RESISTOR; PARTNO: ERJ-6ENF3013V
R35 = rc-master:R_: RESISTOR; PARTNO: ERJ-6ENF1503V
R36 = rc-master:R_: RESISTOR; PARTNO: ERJ-6ENF5621V
R38 = rc-master:R_: RESISTOR; PARTNO: ERJ-6ENF8251V
R42 = rc-master:R_: RESISTOR; PARTNO: ERJ-6ENF1132V
R47 = rc-master:R_: RESISTOR; PARTNO: ERJ-6ENF9312V
R52 = pot:TRIM_EU-: POTENTIOMETER; PARTNO: EVM-EGGA00B25
R53 R60 = rc-master:R_: RESISTOR; PARTNO: ERJ-6ENF3322V
R80 R81 = rc-master:R_: RESISTOR; PARTNO: RC0805JR-070RL
R82 R83 = rc-master:R_: RESISTOR; PARTNO: ERJ-6ENF1001V
RN1 = resistor-array:744-8: CTS 744 Series 4 Resistors, 8 Terminations; PARTNO: 744C083103JPTR
S1 = switch:CK-A; PARTNO: 2M1-SP1-T2-B4-M6RE
TP1-TP7 TP9 = testpad:TP: TEST PIN; BOM: EXCLUDE
TP8 = testpoint:TPS: TEST POINT PAD; BOM: EXCLUDE
TP10 = testpoint:TPS: TEST POINT PAD; BOM: EXCLUDE; LABEL: GND
U1 = maxim:DS1307: Serial I2C Real Time Clock DALLAS Semiconductor; PARTNO: DS1307Z+
U2 = atmel:MEGA1281/2561: MICROCONTROLLER 128 Kbytes FLASH 8 Kbytes SRAM 4 Kbytes EEPROM; PARTNO: ATMEGA1281-16AU
U3 = maxim:MAX3243*: RS-232 Transceivers with AutoShutdown 1µA Supply-Current, True +3V to +5.5V http://dbserv.maxim-ic.com/; PARTNO: MAX3243ECPWR
U4 = v-reg:L78LXXCU/BU: VOLTAGE REGULATOR; PARTNO: L78L33ACUTR
U5 = linear:LM324: OP AMP; PARTNO: LM324D
U6 = linear:CM8870C: CMOS Integrated DTMF Receiver cm8870.pdf; PARTNO: MT8870DS
U7 = maxim:MAX323: ANALOG SWITCH; PARTNO: MAX323CSA+
U8 = cml-micro:MX828: CTCSS/DCS/SELCALL PROCESSOR (OBSOLETE PART!); PARTNO: MX828DW
U9 = isd:ISD4002: VOICE RECORD/PLAYBACK IC 3V, ISP Interface, 120-240 Second Duration; PARTNO: ISD4002-240SY
U10 = linear:TL084: OP AMP; PARTNO: TLC084CD
U11 = v-reg:L78XX: VOLTAGE REGULATOR; PARTNO: L7805ACD2T
U12 = v-reg:AD158X: VOLTAGE REFERENCE Precision a Series Mode Voltage References AD1582/AD1583/AD1584/AD1585; PARTNO: AD1584BRTZ-REEL7
X1 = con-ost:EDSTLZ-2: ON-SHORE; PARTNO: EDSTLZ951/2
X2 = con-subd:NC182M9-VS: SUB-D MALE - NorComp; PARTNO: 182-009-113R531
X3 = con-hdrs40:HDR-1X8: HEADER CONNECTOR; PARTNO: 70553-0007; PLACE: POP X3 OR X4
X4 = con-amp:MTA08: AMP connector; PARTNO: 640454-8; PLACE: POP X3 OR X4
X5 = con-hdrs40:HDR-1X2: HEADER CONNECTOR; PARTNO: 640454-2
Y1 = crystal:CRYTAL: CRYSTAL; PARTNO: ECS-160-18-9X
Y2 = crystal:CRYTAL: CRYSTAL; PARTNO: ECS-35-18-10X
Y3 = crystal:CRYTAL: CRYSTAL; PARTNO: ECS-40.3-20-5PX-TR
Y4 = crystal:CRYTAL: CRYSTAL; PARTNO: ECS-.327-12.5-13X